# Altium schematic sheet schematic_B.SchDoc: STM32 Interface
size A4; SheetNumber: 2; SheetTotal: 3
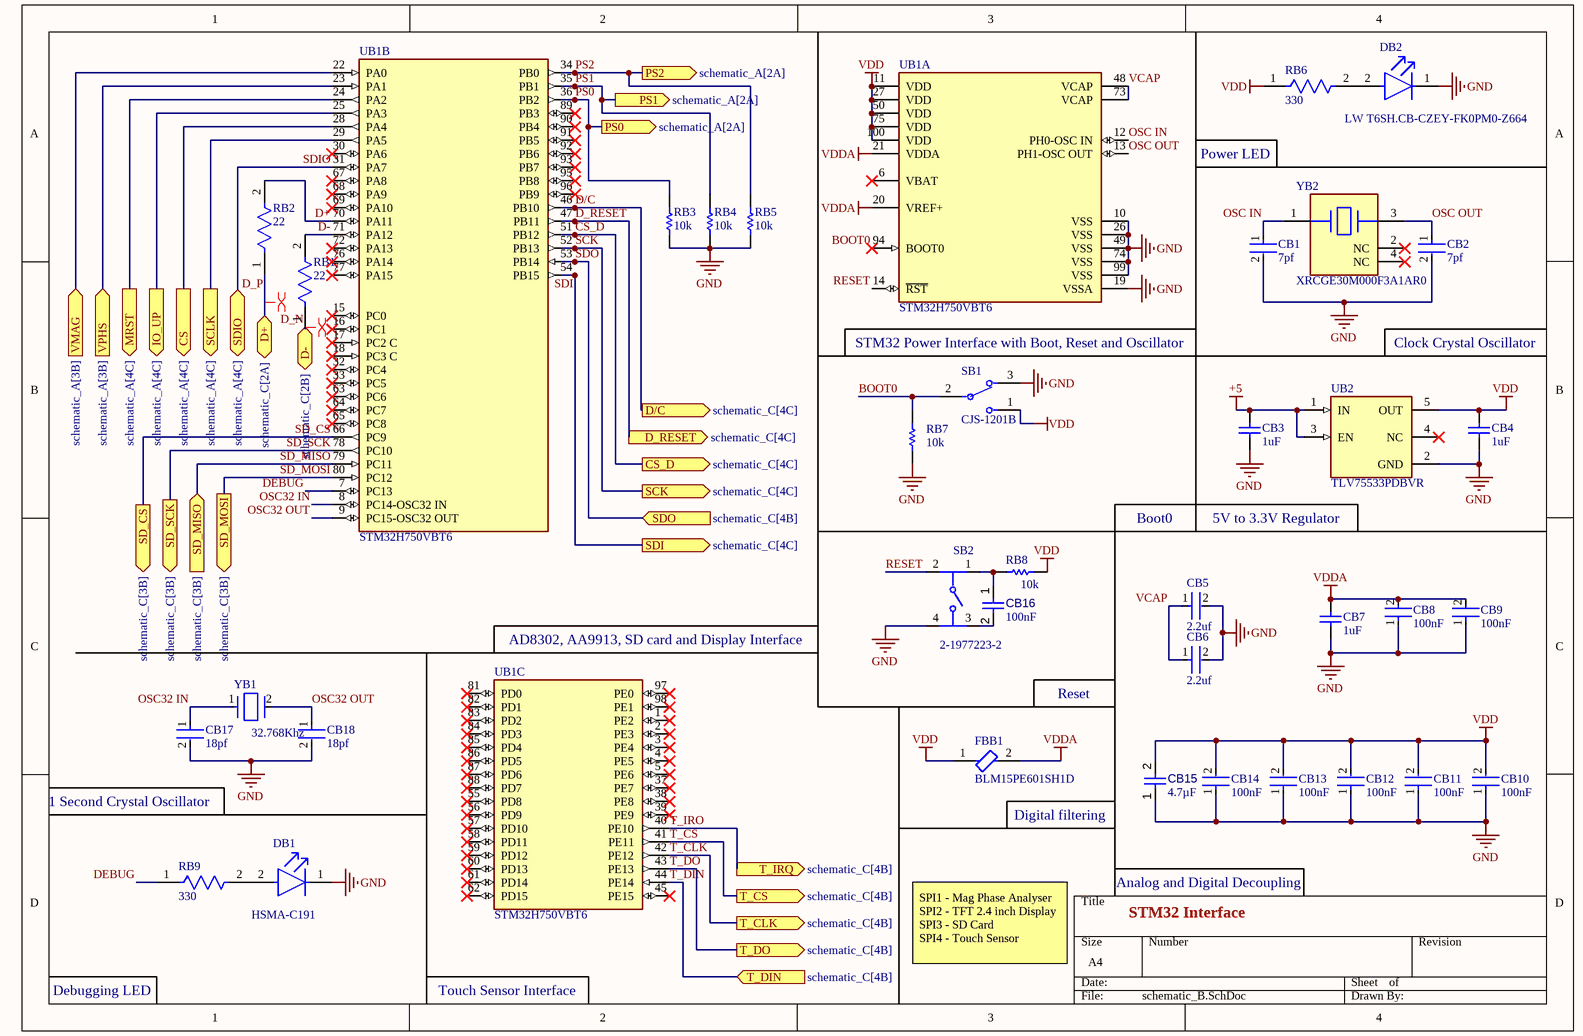
[diagram p0: schematic_B.SchDoc]

## Parts
CB1  7pf  [FP-GRT155-0_05-MFG]
CB2  7pf  [FP-GRT155-0_05-MFG]
CB3  1uF  [CAPC0603X33X15NL03T05]
CB4  1uF  [CAPC0603X33X15NL03T05]
CB5  2.2uf  [FP-GRM155-0_2-IPC_B]
CB6  2.2uf  [FP-GRM155-0_2-IPC_B]
CB7  1uF  [CAPC0603X33X15NL03T05]
CB8  100nF  [FP-0402-L_1_0_0_05-W_0_5-MFG]
CB9  100nF  [FP-0402-L_1_0_0_05-W_0_5-MFG]
CB10  100nF  [FP-0402-L_1_0_0_05-W_0_5-MFG]
CB11  100nF  [FP-0402-L_1_0_0_05-W_0_5-MFG]
CB12  100nF  [FP-0402-L_1_0_0_05-W_0_5-MFG]
CB13  100nF  [FP-0402-L_1_0_0_05-W_0_5-MFG]
CB14  100nF  [FP-0402-L_1_0_0_05-W_0_5-MFG]
CB15  value 4.7µF  [CAPC0805(2012)145_L]  (hidden comment: Capacitor 4.7µF +/-40% 25V 0805)
CB16  value 100nF  [CAPC0402(1005)60_L]  (hidden comment: Capacitor 100nF +/-20% 25V 0402)
CB17  18pf  [FP-GRM033-0_03-IPC_A]
CB18  18pf  [FP-GRM033-0_03-IPC_A]
DB1  HSMA-C191  [FP-HSMA-C191-MFG]
DB2  LW T6SH.CB-CZEY-FK0PM0-Z664  [FP-LW_T6SH_CB-CZEY-FK0PM0-MFG]
FBB1  BLM15PE601SH1D  [FP-BLM15-0_05-MFG]
RB1  22  [FP-RMCF0402-MFG]
RB2  22  [FP-RMCF0402-MFG]
RB3  10k  [RESC1005X40X25LL10T10]
RB4  10k  [RESC1005X40X25LL10T10]
RB5  10k  [RESC1005X40X25LL10T10]
RB6  330  [FP-RMCF0805-IPC_C]
RB7  10k  [RESC1005X40X25LL10T10]
RB8  10k  [RESC1005X40X25LL10T10]
RB9  330  [FP-RMCF0805-IPC_C]
SB1  CJS-1201B  [CJS-1201B_MFG]
SB2  2-1977223-2  [FP-2-1977223-2-MFG]
UB1  STM32H750VBT6  [FP-LQFP100-1L-MFG]  (parts A,B,C of 3)
UB2  TLV75533PDBVR  [FP-DBV0005A-MFG]
YB1  32.768Khz  [FP-ABS09-MFG]
YB2  XRCGE30M000F3A1AR0  [FP-XRCGE-F-A_nbr-MFG]

## Ports
CS (out, see schematic_A[4C]), CS_D (out, see schematic_C[4C]), D+ (bidir, see schematic_C[2A]), D- (bidir, see schematic_C[2B]), D/C (out, see schematic_C[4C]), D_RESET (out, see schematic_C[4C]), IO_UP (out, see schematic_A[4C]), MRST (out, see schematic_A[4C]), PS0 (out, see schematic_A[2A]), PS1 (out, see schematic_A[2A]), PS2 (out, see schematic_A[2A]), SCK (out, see schematic_C[4C]), SCLK (out, see schematic_A[4C]), SD_CS (out, see schematic_C[3B]), SD_MISO (in, see schematic_C[3B]), SD_MOSI (out, see schematic_C[3B]), SD_SCK (out, see schematic_C[3B]), SDI (out, see schematic_C[4C]), SDIO (bidir, see schematic_A[4C]), SDO (in, see schematic_C[4B]), T_CLK (out, see schematic_C[4B]), T_CS (out, see schematic_C[4B]), T_DIN (in, see schematic_C[4B]), T_DO (out, see schematic_C[4B]), T_IRQ (out, see schematic_C[4B]), VMAG (in, see schematic_A[3B]), VPHS (in, see schematic_A[3B])

## Nets
+5: CB3.1 UB2.1(IN) UB2.3(EN)
GND: CB1.2 CB2.2 CB3.2 CB4.2 CB5.2 CB6.2 CB7.2 CB8.1 CB9.1 CB10.1 CB11.1 CB12.1 CB13.1 CB14.1 CB15.1 CB17.2 CB18.2 DB1.1(C) DB2.1(C) RB3.2 RB4.2 RB5.2 RB7.1 SB1.3 SB2.4 UB1.10(VSS) UB1.19(VSSA) UB1.26(VSS) UB1.49(VSS) UB1.74(VSS) UB1.99(VSS) UB2.2(GND)
VDD: CB4.1 CB10.2 CB11.2 CB12.2 CB13.2 CB14.2 CB15.2 FBB1.1 RB6.1 RB8.1 SB1.1 UB1.11(VDD) UB1.27(VDD) UB1.50(VDD) UB1.75(VDD) UB1.100(VDD) UB2.5(OUT)
VDDA: CB7.1 CB8.2 CB9.2 FBB1.2 UB1.20(VREF+) UB1.21(VDDA)
BOOT0: RB7.2 SB1.2(C) UB1.94(BOOT0)
CS: UB1.28(PA4) ; port CS
CS_D: UB1.51(PB12) ; port CS_D
D+: RB2.2 UB1.70(PA11)
D-: RB1.2 UB1.71(PA12)
D/C: UB1.46(PB10) ; port D/C
D_N: RB1.1 ; port D-
D_P: RB2.1 ; port D+
D_RESET: UB1.47(PB11) ; port D_RESET
DEBUG: RB9.1 UB1.7(PC13)
IO_UP: UB1.25(PA3) ; port IO_UP
MRST: UB1.24(PA2) ; port MRST
OSC32 IN: CB17.1 UB1.8(PC14-OSC32_IN) YB1.1
OSC32 OUT: CB18.1 UB1.9(PC15-OSC32_OUT) YB1.2
OSC IN: CB1.1 UB1.12(PH0-OSC_IN) YB2.1
OSC OUT: CB2.1 UB1.13(PH1-OSC_OUT) YB2.3
PS0: RB3.1 UB1.36(PB2) ; port PS0
PS1: RB4.1 UB1.35(PB1) ; port PS1
PS2: RB5.1 UB1.34(PB0) ; port PS2
RESET: SB2.2 UB1.14(~{RST})
SCK: UB1.52(PB13) ; port SCK
SCLK: UB1.29(PA5) ; port SCLK
SD_CS: UB1.66(PC9) ; port SD_CS
SD_MISO: UB1.79(PC11) ; port SD_MISO
SD_MOSI: UB1.80(PC12) ; port SD_MOSI
SD_SCK: UB1.78(PC10) ; port SD_SCK
SDI: UB1.54(PB15) ; port SDI
SDIO: UB1.31(PA7) ; port SDIO
SDO: UB1.53(PB14) ; port SDO
T_CLK: UB1.42(PE12) ; port T_CLK
T_CS: UB1.41(PE11) ; port T_CS
T_DIN: UB1.44(PE14) ; port T_DIN
T_DO: UB1.43(PE13) ; port T_DO
T_IRO: UB1.40(PE10) ; port T_IRQ
VCAP: CB5.1 CB6.1 UB1.48(VCAP) UB1.73(VCAP)
VMAG: UB1.22(PA0) ; port VMAG
VPHS: UB1.23(PA1) ; port VPHS
NetCB16_1: CB16.1 RB8.2 SB2.1
NetCB16_2: CB16.2 SB2.3
NetDB1_2: DB1.2(A) RB9.2
NetDB2_2: DB2.2(A) RB6.2

Not connected (* = marked no-connect by the designer): UB1 1(PE2)* 2(PE3)* 3(PE4)* 4(PE5)* 5(PE6)* 6(VBAT)* 15(PC0)* 16(PC1)* 17(PC2_C)* 18(PC3_C)* 30(PA6)* 32(PC4)* 33(PC5)* 37(PE7)* 38(PE8)* 39(PE9)* 45(PE15)* 55(PD8)* 56(PD9)* 57(PD10)* 58(PD11)* 59(PD12)* 60(PD13)* 61(PD14)* 62(PD15)* 63(PC6)* 64(PC7)* 65(PC8)* 67(PA8)* 68(PA9)* 69(PA10)* 72(PA13)* 76(PA14)* 77(PA15)* 81(PD0)* 82(PD1)* 83(PD2)* 84(PD3)* 85(PD4)* 86(PD5)* 87(PD6)* 88(PD7)* 89(PB3)* 90(PB4)* 91(PB5)* 92(PB6)* 93(PB7)* 95(PB8)* 96(PB9)* 97(PE0)* 98(PE1)*; UB2 4(NC)*; YB2 2(NC)* 4(NC)*

## Layout directives
differential pair: D_N, D_P

## Notes on the sheet
- Power LED
- STM32 Power Interface with Boot, Reset and Oscillator
- Clock Crystal Oscillator
- Boot0
- 5V to 3.3V Regulator
- (near UB1) AD8302, AA9913, SD card and Display Interface
- Reset
- 1 Second Crystal Oscillator
- Digital filtering
- Analog and Digital Decoupling
- Debugging LED
- Touch Sensor Interface
- SPI1 - Mag Phase Analyser
  SPI2 - TFT 2.4 inch Display
  SPI3 - SD Card
  SPI4 - Touch Sensor

## Library data of the parts
CB1 CB2 = CMP-06035-039053-1: Multi-Layer Ceramic Capacitor 7pF 50V C0G ±0.5pF 0402 Paper T/R
CB3 CB4 CB7 = CMP-2010-00160-1: Part Number: 02016D105KAT2A; Manufacturer: AVX Interconnect / Elco
CB5 CB6 = CMP-06035-053544-1: Chip Multilayer Ceramic Capacitors for General Purpose, 0402, 2.2uF, X7R, 15%, 10%, 10V
CB8-CB14 = CMP-14477-003271-3: Ceramic Capacitor General Use 0.1uF ±10% 25V X5R 0402; NexarPartId: 49252556; Max Thickness: 550µm; Min Operating Temperature: -55°C; Material: Ceramic; Capacitance: 100nF; Min Length: 950µm; Packaging: Tape & Reel (TR); Min Width: 450µm; Thickness: 558.8µm; Tolerance: 10%; Length: 990.6µm; Case/Package: 0402; Mount: Surface Mount; Height: 550µm; Max Length: 1.05mm; Halogen Free: Halogen Free; Voltage Rating: 25V; Max Operating Temperature: 85°C; Max Width: 550µm; Min Thickness: 450µm; RoHS: Compliant; Width: 508µm; Voltage Rating (DC): 25V
CB15 = CMP-001-00080-4: Chip Capacitor, 4.7µF +/-40%, 25V, 0805, Thickness 1.45 mm; Tolerance: 20%; Voltage Rating: 25V; Min Operating Temperature: -55°C; Max Operating Temperature: 85°C; Pins: 2; Mounting Technology: SMT; Case/Package: 0805
CB16 = CMP-001-00065-4: Chip Capacitor, 100nF +/-20%, 25V, 0402, Thickness 0.6 mm; Tolerance: 10%; Max Operating Temperature: 85°C; Min Operating Temperature: -55°C; Pins: 2; Voltage Rating: 25V; Mounting Technology: SMT; Case/Package: 0402
CB17 CB18 = CMP-06035-001884-1: Chip Multilayer Ceramic Capacitors for General Purpose, 0201, 18pF, C0G, 30ppm/°C, 1%, 25V; Case Code (Imperial): 0201; Length: 0.024inch; Mount: Surface Mount; Max Operating Temperature: 125°C; Tolerance: 1%; Min Operating Temperature: -55°C; Capacitance: 18pF; Case Code (Metric): 0603; Height: 0.3mm; Case/Package: 0201; Thickness: 0.013inch; Voltage Rating: 25V; Termination: SMD/SMT; Dielectric: C0G; Package Quantity: 15000; Voltage Rating (DC): 25V; Packaging: Tape and Reel; Width: 0.3mm
DB1 = CMP-02129-71131210-1: HSMA-C191 LED Low-Power Uni-Color Amber 595nm 1.9V 2-Pin Chip LED T/R; Max Junction Temperature (Tj): 95°C; Lens Transparency: Diffused; Test Current: 20mA; Illumination Color: Orange; Viewing Angle: 170°; Reverse Voltage: 5V; Luminous Intensity: 90mcd; Power Rating: 60mW; Number of Elements: 1; Wavelength: 592nm; Lens Color: Clear, White; Voltage Rating (DC): 1.9V; Peak Wavelength: 595nm; Lens Style: Diffused; Forward Current: 20mA; Case/Package: 0603; RoHS: Compliant; Forward Voltage: 1.9V; Height: 600µm; Max Operating Temperature: 85°C; Width: 800µm; Case Code (Metric): 1608; Power Dissipation: 60mW; Color: Orange; Number of LEDs: 1; Case Code (Imperial): 0603; Number of Pins: 2; Min Operating Temperature: -40°C; Lead Free: Lead Free; NexarPartId: 71131210; Depth: 800µm; REACH SVHC: No SVHC; Length: 1.6mm; Packaging: Tape and Reel; Mount: Surface Mount; Dominant Wavelength: 592nm
DB2 = CMP-62016-000075-1: TOPLED
FBB1 = CMP-00260-117051428-1: BLM15PE601SH1D Ferrite Bead, 600 Ohm, 25%, 0402 Rohs Compliant: Yes; Test Frequency: 100MHz; Resistance: 400mΩ; RMS Current (Irms): 700mA; Tolerance: 25%; Height: 550µm; Lifecycle Status: Production; NexarPartId: 117051428; Case/Package: 0402; Min Operating Temperature: -55°C; Series Resistance: 400mΩ; Max Operating Temperature: 125°C; Core Material: Ferrite
RB1 RB2 = CMP-26527-006952-1: 22Ω ±1% 0.063W 0402 Thick Film Chip Resistor AEC-Q200 compliant; Temperature Coefficient: 100ppm/°C; Resistance: 22R; Max Power Dissipation: 63mW; RoHS Compliant: Yes; Min Operating Temperature: -55°C; Features: Automotive AEC-Q200; Max Operating Temperature: 155°C; Number of Terminations: 2; Length: 0.039inch; Height: 0.016inch; Tolerance: 1%; Packaging: Tape and Reel; Width: 0.02inch; Resistor Type: Thick Film; Contact Plating: Tin; Case/Package: 0402; Series: RMCF; Mount: Surface Mount
RB3-RB5 RB7 RB8 = CMP-2002-04584-1: Manufacturer: KOA Speer; Part Number: SG73P1ETTP1002F
RB6 RB9 = CMP-26527-004125-1: 330Ω ±5% 0.125W 0805 Thick Film Chip Resistor AEC-Q200 compliant; Power Rating: 125mW; Temperature Coefficient: 200ppm/°C; Resistance: 330R; RoHS Compliant: Yes; Case Code (Imperial): 0805; Features: Automotive AEC-Q200; Mount: Surface Mount; Length: 2mm; Case Code (Metric): 2012; Series: RMCF; Construction: Rectangular; Radiation Hardening: No; Tolerance: 5%; Depth: 1.25mm; Military Standard: Not; Resistor Type: Thick Film; Min Operating Temperature: -55°C; Lead Free: Lead Free; Max Operating Temperature: 155°C; Number of Terminations: 2; Contact Plating: Tin; Width: 0.049inch; Height: 0.026inch; Size Code: 0805; Case/Package: 0805; Max Power Dissipation: 125mW; Packaging: Tape and Reel
SB1 = CMP-08360-85278913-1: Slide Switch, SPDT, 100mA, 6V, Flush, Surface Mount, CJS Series; Actuator Material: Polyamide; Life (Cycles): 200cycles; Number of Circuits: 1; Contact Resistance: 100mΩ; Number of Positions: 3; Max Voltage Rating (DC): 24V; Contact Material: Gold; ComponentLink2Description: Datasheet URL; Case/Package: SMD/SMT; Throw Configuration: SPDT; Voltage Rating (DC): 6V; Radiation Hardening: No; ComponentLink2URL: https://www.nidec-components.com/e/catalog/switch/cjs.pdf; Mount: Surface Mount; Max Operating Temperature: 85°C; RoHS: Compliant; Contact Current Rating: 100mA; Packaging: Bulk; Termination: Gull Wing; HelpURL: https://www.nidec-components.com/e/catalog/switch/cjs.pdf; Contact Plating: Gold; Min Operating Temperature: -40°C; Height: 2.5mm
SB2 = CMP-03407-000026-1: SWITCH TACTILE SPST-NO 0.05A 24V; RoHS Compliant: Yes
UB1 = CMP-12105-000017-1: IC MCU 32BIT 128KB FLASH 100LQFP; Manufacturer: STMicroelectronics; Number Of Uart Channels: 9; Number Of I/Os: 82; Max Junction Temp: +125°C; Data Bus Width: 32bits; Ram Size: 1MBytes; Min Supply Voltage: 1.62V; Number Of Spi Channels: 6; Number Of Adc Channels: 36; Max Supply Voltage: 3.6V; Standoff Height: 0.05mm; Interface: I2C,SPI,UART,USART,CAN,USB,LIN,IrDA,Ethernet,I2S,Other; Number Of A/D Converters: 3; Number Of I2C Channels: 4; Memory Size: 128KBytes; Frequency: 480MHz; Number Of Timers/Counters: 20; Number Of Ethernet Channels: 1; Core Architecture: ARM Cortex-M7; Number Of Usb Channels: 2; Number Of Pwm Channels: 42; Ambient Temperature Range High: +85°C; Temperature: -40°C to +125°C; ComponentLink2URL: https://www.st.com/resource/en/datasheet/stm32h750vb.pdf; Device Class L2: Embedded Processors and Controllers; Temperature Range Low: -40°C; Octopart: https://octopart.com/stm32h750vbt6-stmicroelectronics-94048547; Category: IC; Manufacturer Part Number: STM32H750VBT6; Height: 1.6mm; Lead Free: Yes; Device Class L1: Integrated Circuits (ICs); Digikey Description: IC MCU 32BIT 128KB FLASH 100LQFP; RoHS: TRUE; Ambient Temperature Range Low: -40°C; Device Class L3: Microcontrollers; ComponentLink2Description: Datasheet; Mouser Description: MCU 32-Bit STM32H750VB ARM Cortex M7 RISC 128KB Flash 1.8V/2.5V/3.3V 100-Pin LQFP Tray; Number Of Cores: 1; Automotive: No; Memory Type: FLASH; Package: LQFP100-1L; Temperature Range High: +125°C
UB2 = CMP-04917-000010-1: IC REG LINEAR 3.3V 500MA SOT23-5; Manufacturer: Texas Instruments; Dropout Voltage: 150mV; Max Junction Temp: +125°C; Number Of Outputs: 1; Output Type: Fixed; Accuracy Percentage: 1%; Standoff Height: 0mm; Max Supply Voltage: 5.5V; Min Supply Voltage: 1.45V; RoHS: TRUE; ComponentLink2Description: Datasheet; Octopart: https://octopart.com/tlv75533pdbvr-texas+instruments-91272349; Ambient Temperature Range High: +70°C; Device Class L2: Power Management ICs; Lead Free: Yes; Temperature Range Low: -40°C; Output Current: 500mA; Temperature: -40°C to +125°C; Automotive: No; Manufacturer Part Number: TLV75533PDBVR; Digikey Description: IC REG LINEAR 3.3V 500MA SOT23-5; Height: 1.45mm; Temperature Range High: +125°C; ComponentLink2URL: http://www.ti.com/lit/ds/symlink/tlv755p.pdf; Device Class L3: Voltage Regulators - Linear; Device Class L1: Integrated Circuits (ICs); Output Voltage: 3.3V; Mouser Description: 500-mA low-IQ small-size low-dropout (LDO) regulator 5-SOT-23 -40 to 125; Package: DBV0005A; Category: IC
YB1 = CMP-27762-005385-1: CRYSTAL 32.7680KHZ 12.5PF SMD; ESR (Equivalent Series Resistance): 70kR; Tolerance: 10ppm; Operating Frequency: 32.768 kHz; Package Quantity: 3000; Lead Free: Lead Free; Frequency: 32.768kHz; Load Capacitance: 12.5pF; Series Resistance: 70kR; Series: ABS09; Min Operating Temperature: -40°C; Frequency Tolerance: 10ppm; Packaging: Tape and Reel; Termination: SMD/SMT; RoHS Compliant: Yes; Width: 1.5mm; Number of Pins: 2; Case/Package: CSMD; Mount: Surface Mount; Height: 0.035inch; Length: 4.1mm; Depth: 1.5mm; Max Operating Temperature: 85°C
YB2 = CMP-06054-000025-1: 30 MHz ±45ppm Crystal 6pF 70 Ohms 4-SMD, No Lead